# EasyEDA Pro project ProProject_Pet_Tracker_V2_Hardware_PRO.epro, board Shield_board_PCB_v1
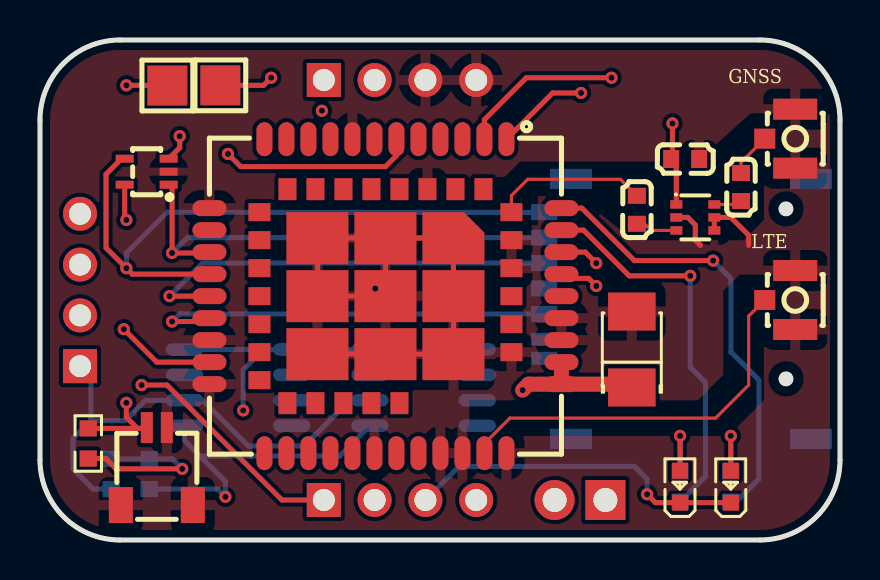
[diagram p4: board, top side]
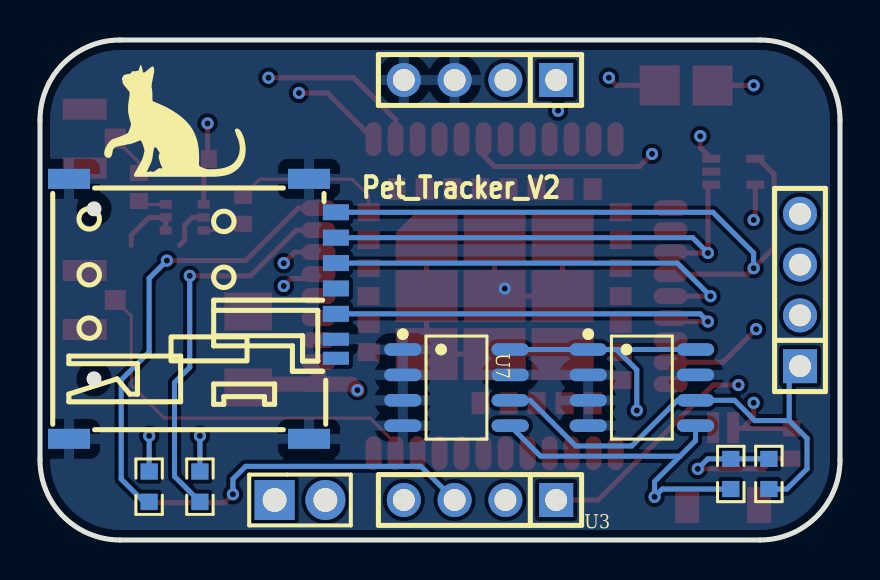
[diagram p5: board, bottom side, seen from below]

Outline 40 x 25 mm; copper layers: Top Layer, Inner1, Inner2, Bottom Layer. Coordinates in mm from the lower left corner of the outline.
Outline path: 0,21 0,4 arc(1.17,1.17) 4,0 36,0 arc(38.83,1.17) 40,4 40,21 arc(38.83,23.83) 36,25 4,25 arc(1.17,23.83) 0,21
Stack: Top Layer 0.035mm 外层铜厚1oz / Dielectric1 0.0994mm 3313 RC57% 4.2mil / Inner1 0.0152mm 内层铜厚 / Dielectric2 1.265mm 1.3mm H/HOZ 含铜 / Inner2 0.0152mm 内层铜厚 / Dielectric3 0.0994mm 3313 RC57% 4.2mil / Bottom Layer 0.035mm 外层铜厚1oz

## Design rules (mm)
template: JLCPCB Capability(Two Layers Board)
spacing copperThickness1oz (default): track to track 0.102, other pairs 0.152 to 0.3
spacing copperThickness2oz: track to track 0.203, other pairs 0.152 to 0.3
track width copperThickness1oz (default): min 0.127, default 0.254, max 2.54
track width copperThickness2oz: min 0.203, default 0.254, max 2.54
differential pair differentialPair (default): width min 0.127, default 0.254, max 2.54; gap min 0.152, default 0.152
via viaSize (default): diameter min 0.5, default 0.61, max 10; hole min 0.3, default 0.305, max 6.3

## Placement (name value [footprint] x y rotation side)
C1  100pF  [C0603]  35.05 17.65 90 top
C3  470pF  [C0603]  32.26 19.05 180 top
C4  100pF  [C0603]  29.84 16.51 270 top
C5  100uF  [CAP-SMD_L3.5-W2.8-R-RD]  29.59 9.53 270 top
CARD1  SMN-303  [SIM-SMD_SMN-303]  31.88 11.56 270 bottom
CN1  SM02B-SRSS-TB  [CONN-SMD_2P-P1.00_SM02B-SRSS-TB-LF-SN]  5.84 3.68 0 top
D1  ESDA6V1W5  [SC-70-5_L2.1-W1.3-P0.65-LS2.1-BR]  5.33 18.42 0 top
GNSS  BWIPX-1-001E  [IPEX-SMD_BWIPX-1-001E]  37 20.07 0 top
H2  UART  [HDR-TH_2P-P2.54-V-M]  27 2 180 bottom
LED1  RED  [LED0603-RD_RED]  34.54 2.67 90 top
LED2  RED  [LED0603-RD_RED]  32 2.67 90 top
LTE  BWIPX-1-001E  [IPEX-SMD_BWIPX-1-001E]  37 12 0 top
R1  100Ω  [R0603]  34.54 2.67 270 bottom
R4  10kΩ  [R0603]  2.41 4.83 270 top
R5  4.7kΩ  [R0603]  5.46 3.3 90 bottom
R6  4.7kΩ  [R0603]  3.56 3.3 90 bottom
R7  100Ω  [R0603]  32 2.67 270 bottom
TP1  T_P  [PAD]  6.37 22.72 0 top
TP2  T_P  [PAD]  9.02 22.73 0 top
U1  SIM7080G  [LCC-SMD_SIM7080G]  17.27 12.19 270 top
U2  I2C  [HDR-TH_4P-P2.54-V-M]  2 12.5 90 bottom
U3  GPIO  [HDR-TH_4P-P2.54-V-M]  18 2 0 bottom
U4  POWER  [HDR-TH_4P-P2.54-V-M]  18 23 0 bottom
U6  BGA2817,115  [SC-70-6_L2.0-W1.3-P0.65-LS2.1-BR]  32.77 16.13 180 top
U7  AT24C256CDRG  [SOP-8_L4.9-W3.9-P1.27-LS6.0-BL]  19.18 7.62 270 bottom
U8  AT24C256CDRG  [SOP-8_L4.9-W3.9-P1.27-LS6.0-BL]  9.91 7.62 270 bottom

## Footprints (pads in the part's own frame, mm; a bottom-side part is the same pattern mirrored in y, then rotated)
C0603
  rect 0.8x0.9 smd: 1(-0.7,0) 2(0.7,0)
CAP-SMD_L3.5-W2.8-R-RD
  rect 1.9x2.376 smd: 1(1.899,0) 2(-1.899,0)
CONN-SMD_2P-P1.00_SM02B-SRSS-TB-LF-SN
  rect 0.6x1.55 smd: 1(-0.5,1.938) 2(0.5,1.938)
  rect 1.2x1.8 smd: 3(1.8,-1.938) 4(-1.8,-1.938)
HDR-TH_2P-P2.54-V-M
  rect 2x2 hole 1.2: 1(-1.27,0)
  round 2 hole 1.2: 2(1.27,0)
HDR-TH_4P-P2.54-V-M
  rect 1.7x1.7 hole 1.1: 1(-3.81,0)
  round 1.7 hole 1.1: 2(-1.27,0) 3(1.27,0) 4(3.81,0)
IPEX-SMD_BWIPX-1-001E
  rect 1.05x1 smd: 1(-0.762,0)
  rect 2.2x1.05 smd: 2(0.762,-1.475) 3(0.762,1.475)
LCC-SMD_SIM7080G
  oval 1.7x0.8 smd: 1(-7.85,6.05) 2(-7.85,4.95) 3(-7.85,3.85) 4(-7.85,2.75) 5(-7.85,1.65) 6(-7.85,0.55) 7(-7.85,-0.55) 8(-7.85,-1.65) 9(-7.85,-2.75) 10(-7.85,-3.85) 11(-7.85,-4.95) 12(-7.85,-6.05) 22(7.85,-6.05) 23(7.85,-4.95) 24(7.85,-3.85) 25(7.85,-2.75) 26(7.85,-1.65) 27(7.85,-0.55) 28(7.85,0.55) 29(7.85,1.65) 30(7.85,2.75) 31(7.85,3.85) 32(7.85,4.95) 33(7.85,6.05)
  oval 0.8x1.7 smd: 13(-4.4,-8.8) 14(-3.3,-8.8) 15(-2.2,-8.8) 16(-1.1,-8.8) 17(0,-8.8) 18(1.1,-8.8) 19(2.2,-8.8) 20(3.3,-8.8) 21(4.4,-8.8) 34(4.4,8.8) 35(3.3,8.8) 36(2.2,8.8) 37(1.1,8.8) 38(0,8.8) 39(-1.1,8.8) 40(-2.2,8.8) 41(-3.3,8.8) 42(-4.4,8.8)
  rect 1.1x0.9 smd: 43(-5.35,4.9) 44(-5.35,3.5) 45(-5.35,2.1) 46(-5.35,0.7) 47(-5.35,-0.7) 48(-5.35,-2.1) 49(-5.35,-3.5) 50(-5.35,-4.9) 58(5.35,-4.9) 59(5.35,-3.5) 60(5.35,-2.1) 61(5.35,-0.7) 62(5.35,0.7)
  rect 0.9x1.1 smd: 51(-4.2,-6.3) 52(-2.8,-6.3) 53(-1.4,-6.3) 54(0,-6.3) 55(1.4,-6.3) 56(2.8,-6.3) 57(4.2,-6.3) 63(2.8,6.3) 64(1.4,6.3) 65(0,6.3) 66(-1.4,6.3) 67(-2.8,6.3) 68(-4.2,6.3)
  custom 2.6x3.1 smd: 69(-2.9,3.4)
  rect 2.6x3.1 smd: 70(-2.9,0) 71(-2.9,-3.4) 72(0,-3.4) 73(2.9,-3.4) 74(2.9,0) 75(2.9,3.4) 76(0,3.4) 77(0,0)
LED0603-RD_RED
  rect 0.8x0.8 smd: 1(-0.799,-0.004) 2(0.799,0.004)
PAD
  rect 2x2 smd: 1(0,0)
R0603
  rect 0.806x0.864 smd: 1(-0.753,0) 2(0.753,0)
SC-70-5_L2.1-W1.3-P0.65-LS2.1-BR
  rect 0.9x0.4 smd: 1(1.1,-0.65) 2(1.1,0) 3(1.1,0.65) 4(-1.1,0.65) 5(-1.1,-0.65)
SC-70-6_L2.0-W1.3-P0.65-LS2.1-BR
  rect 0.6x0.42 smd: 1(0.95,-0.65) 2(0.95,0) 3(0.95,0.65) 4(-0.95,0.65) 5(-0.95,0) 6(-0.95,-0.65)
SIM-SMD_SMN-303
  rect 1x2.1 smd: 8(-6.5,5.328) 9(6.5,5.328) 10(6.5,-6.672) 11(-6.5,-6.672)
  rect 0.8x1.3 smd: C1(0.25,6.672) C2(-2.29,6.672) C3(-4.83,6.672) C6(-1.02,6.672) C7(-3.56,6.672)
  rect 0.65x1.3 smd: C5(1.52,6.672) CD(2.47,6.672)
SOP-8_L4.9-W3.9-P1.27-LS6.0-BL
  oval 0.63x1.865 smd: 1(-1.905,-2.683) 2(-0.635,-2.683) 3(0.635,-2.683) 4(1.905,-2.683) 5(1.905,2.683) 6(0.635,2.683) 7(-0.635,2.683) 8(-1.905,2.683)

## Nets
As in the schematic, except:
GND: C3.1 C5.2 CARD1.8 CARD1.9 CARD1.10 CARD1.11 CARD1.C5 CN1.2 CN1.3 CN1.4 D1.2 GNSS.2 GNSS.3 LTE.2 LTE.3 U1.8 U1.13 U1.19 U1.21 U1.27 U1.30 U1.31 U1.33 U1.36 U1.37 U1.45 U1.63 U1.66 U1.67 U1.69 U1.70 U1.71 U1.72 U1.73 U1.74 U1.75 U1.76 U1.77 U4.3 U4.4 U6.2 U6.4 U6.5 U7.1 U7.2 U7.3 U7.4 U7.7 U8.2 U8.3 U8.4 U8.7
$C1_2: C1.2 GNSS.1
LTE_RF: LTE.1 U1.32

Pads without a net: CARD1 C6 CD; U1 3 4 5 7 9 10 11 12 14 22 23 24 25 26 28 29 38 43 44 46 47 48 49 50 51 52 53 54 55 56 57 58 59 60 61 62 64 65

## Via types
v1: diameter 0.61, hole 0.305, Top Layer to Bottom Layer, 28 vias

## Routing (per net, layer and track width the routed paths; a pad name or vN(x,y) marks a point on that pad's centre or on a via; arc(x,y) is an arc through that point)
3V3: length 66.9
  Top Layer w0.254: U6.1 31.82,18.79 C3.2 31.62,19.11 v1(31.62,20.83) ; v1(7.11,3.56) 3.81,3.56 3.29,4.07 R4.2
  Inner1 w0.254: v1(10.16,6.48) 9.78,6.86 9.78,7.62 9.53,7.87 9.53,18.16 14.19,22.83 U4.1 16.36,20.83 v1(31.62,20.83)
  Inner2 w0.254: v1(7.11,3.56) 10.03,6.48 v1(10.16,6.48)
  Bottom Layer w0.254: R6.2 R5.2 6.61,4.06 v1(7.11,3.56) ; U7.8 U8.1 11.18,9.53 ; 11.18,9.53 U8.8 ; 11.18,9.53 10.16,8.51 v1(10.16,6.48)
4V: length 25.3
  Top Layer w0.75: v1(24.13,7.49) 24.43,7.79 U1.34 ; U1.35 U1.34 ; U1.34 29.43,7.79 C5.1
  Inner2 w0.75: U4.2 24.13,15.6 v1(24.13,7.49)
GND: length 34.3
  Top Layer w0.254: U1.70 U1.69 U1.76 U1.75 U1.74 U1.73 ; U1.70 U1.77 U1.72 13.87,14.63 14.33,15.09 ; U1.70 14.33,15.09 ; 35.43,14.73 35.43,15.24 34.54,16.13 U6.5 U6.4 ; 14.33,15.09 U1.71 ; 33.02,14.73 32.77,14.99 32.77,15.75 32.38,16.13 U6.2
  vias: v1(16.76,12.57)
$C1_1: length 1.4
  Top Layer w0.158: C1.1 34.88,16.78 U6.6
$C1_2: length 2.2
  Top Layer w0.158: GNSS.1 35.05,18.88 C1.2
$C4_2: length 2.1
  Top Layer w0.158: U6.3 30.56,15.48 30.23,15.81 C4.2
$LED1_2: length 3.5
  Top Layer w0.254: LED1.2 v1(34.54,5.21)
  Bottom Layer w0.254: R1.1 34.54,3.42 v1(34.54,5.21)
$LED2_2: length 3.5
  Top Layer w0.254: v1(32,5.21) 32,3.47 LED2.2
  Bottom Layer w0.254: R7.1 v1(32,5.21)
$TP1_1: length 20
  Top Layer w0.254: v1(4.19,10.54) 5.84,8.89 U1.20 ; v1(4.32,22.73) 6.36,22.73 TP1.1
  Inner1 w0.254: v1(4.32,22.73) 3.3,21.72 3.3,12.57 4.19,11.68 v1(4.19,10.54)
$TP2_1: length 25.4
  Top Layer w0.254: v1(27.81,13.84) 27.26,14.39 U1.40 ; TP2.1 11.18,22.73 v1(11.56,23.11)
  Inner1 w0.254: v1(14.1,21.46) 21.21,14.35 27.43,14.35 27.81,13.97 v1(27.81,13.84)
  Inner2 w0.254: v1(11.56,23.11) 11.94,22.73 11.94,21.84 12.32,21.46 v1(14.1,21.46)
GNSS_RF: length 7.8
  Top Layer w0.158: C4.1 29.02,18.03 24.38,18.03 23.57,17.22 U1.68
I2C1_SCL: length 24.3
  Bottom Layer w0.254: 2.54,5.97 1.65,5.08 1.65,3.56 2.66,2.55 R6.1 ; 2.54,5.97 2.54,8.15 U2.1 ; 2.54,5.97 4.26,5.97 5.27,6.98 U8.6 8.13,6.98 10.41,4.7 13.21,4.7 15.49,6.98 U7.6
I2C1_SDA: length 30.8
  Inner1 w0.254: v1(9.27,2.16) 7.24,2.16 3.43,5.97 3.43,9.8 U2.2
  Bottom Layer w0.254: 8,4.19 9.27,2.92 v1(9.27,2.16) 8.88,2.55 R5.1 ; 8,4.19 7.22,4.97 U8.5 ; 8,4.19 14.97,4.19 U7.5
LTE_RF: length 19.7
  Top Layer w0.158: LTE.1 35.43,11.2 35.43,7.75 33.78,6.1 23.5,6.1 22.07,4.67 22.07,4.34 U1.32
M_POWER: length 15.2
  Top Layer w0.254: U1.39 26.28,13.08 27.43,13.08 v1(27.81,12.7)
  Inner1 w0.254: v1(27.81,12.7) 21.81,6.7 U3.4
M_SLEEP: length 34.6
  Top Layer w0.254: U3.1 12.1,2 6.35,7.75 v1(5.08,7.75) ; v1(9.4,19.3) 10.03,18.67 17.27,18.67 17.82,19.22 U1.6
  Inner1 w0.254: v1(9.4,19.3) 5.08,14.99 v1(5.08,7.75)
N_LED: length 19.5
  Top Layer w0.254: v1(32.51,13.21) 29.46,13.21 27.18,15.49 U1.41
  Bottom Layer w0.254: R7.2 33.27,3.18 33.27,7.87 32.51,8.64 v1(32.51,13.21)
NET_LED: length 17.2
  Top Layer w0.254: LED1.1 LED2.1 30.77,1.87 v1(30.35,2.29)
  Bottom Layer w0.254: v1(30.35,2.29) 30.35,3.05 29.72,3.68 20.95,3.68 U3.3
P_ON: length 18.9
  Top Layer w0.254: R4.1 4.88,5.58 ; 4.88,5.58 4.32,6.14 v1(4.32,6.86) ; 4.88,5.58 5.3,5.58 CN1.1
  Inner1 w0.254: U3.2 13.9,4.83 6.35,4.83 v1(4.32,6.86)
S_LED: length 22.4
  Top Layer w0.254: v1(33.66,13.97) 29.72,13.97 27.1,16.59 U1.42
  Bottom Layer w0.254: R1.2 34.81,1.91 35.94,3.05 35.94,8 34.54,9.4 34.54,13.08 v1(33.66,13.97)
SIM_CLK: length 33.1
  Top Layer w0.254: 4.23,19.06 4.08,19.06 3.3,18.29 3.3,14.61 v1(4.32,13.59) 4.62,13.29 U1.16
  Bottom Layer w0.254: CARD1.C3 6.35,16.39 4.32,14.35 v1(4.32,13.59)
SIM_DATA: length 24.3
  Top Layer w0.254: D1.1 6.6,17.59 v1(6.6,14.35) 8.43,14.35 U1.15
  Bottom Layer w0.254: v1(6.6,14.35) 7.37,15.12 CARD1.C7
SIM_RST: length 32.3
  Top Layer w0.254: 6.43,19.06 6.99,19.62 v1(6.99,20.19) ; v1(6.48,12.19) U1.17
  Inner2 w0.254: v1(6.99,20.19) 6.1,20.19 5.46,19.56 5.46,16.64 5.97,16.13 5.97,12.7 v1(6.48,12.19)
  Bottom Layer w0.254: v1(6.48,12.19) 8.13,13.85 CARD1.C2
SIM_VCC: length 28.9
  Top Layer w0.254: U1.18 8.3,10.92 v1(6.6,10.92) ; D1.5 4.23,16.09 v1(4.32,16)
  Inner2 w0.254: v1(6.6,10.92) 5.97,10.92 5.08,11.81 5.08,15.24 v1(4.32,16)
  Bottom Layer w0.254: CARD1.C1 6.99,11.31 v1(6.6,10.92)
UART2_RX: length 25.6
  Top Layer w0.254: v1(27.05,22.35) 25.63,22.35 U1.1
  Inner2 w0.254: H2.2 27.05,3.32 v1(27.05,22.35)
UART2_TX: length 30.9
  Top Layer w0.254: U1.2 22.22,21.02 24.32,23.11 v1(28.57,23.11)
  Inner2 w0.254: H2.1 30.35,4.08 30.35,21.34 v1(28.57,23.11)

## Copper pours and planes (outline as drawn; the poured copper is in the pictures)
GND on Top Layer: -0.13,0 40,0 40.13,0.13 40.13,39.62 33.4,39.62 32.38,38.61 32.38,25.4 32.51,25.27 0.38,25.27 -0.25,24.64 -0.25,0.13
GND on Bottom Layer: -1.02,-1.4 39.5,-1.4 40.51,-0.38 40.51,26.16 40.64,26.29 11.68,26.29 11.43,26.03 11.43,37.85 11.3,37.97 -0.76,37.97 -1.02,37.72
GND on Inner1: -0.38,-0.13 39.88,-0.13 40.51,0.51 40.51,24.77 39.37,25.91 31.62,25.91 32.26,26.54 32.26,38.99 22.99,38.99 22.99,26.16 22.86,26.03 -0.13,26.03 -0.38,25.78
GND on Inner2: -0.63,-0.13 40.54,-0.13 41.05,-0.64 41.05,25.4 21.59,25.4 21.34,25.65 21.34,37.47 20.19,38.61 13.21,38.61 13.08,38.73 13.08,26.54 11.94,25.4 -0.38,25.4 -0.38,0.13

## Text on the board
Bottom Silkscreen Layer: Pet_Tracker_V2
